# EAGLE design project github (EAGLE 9.6.1)
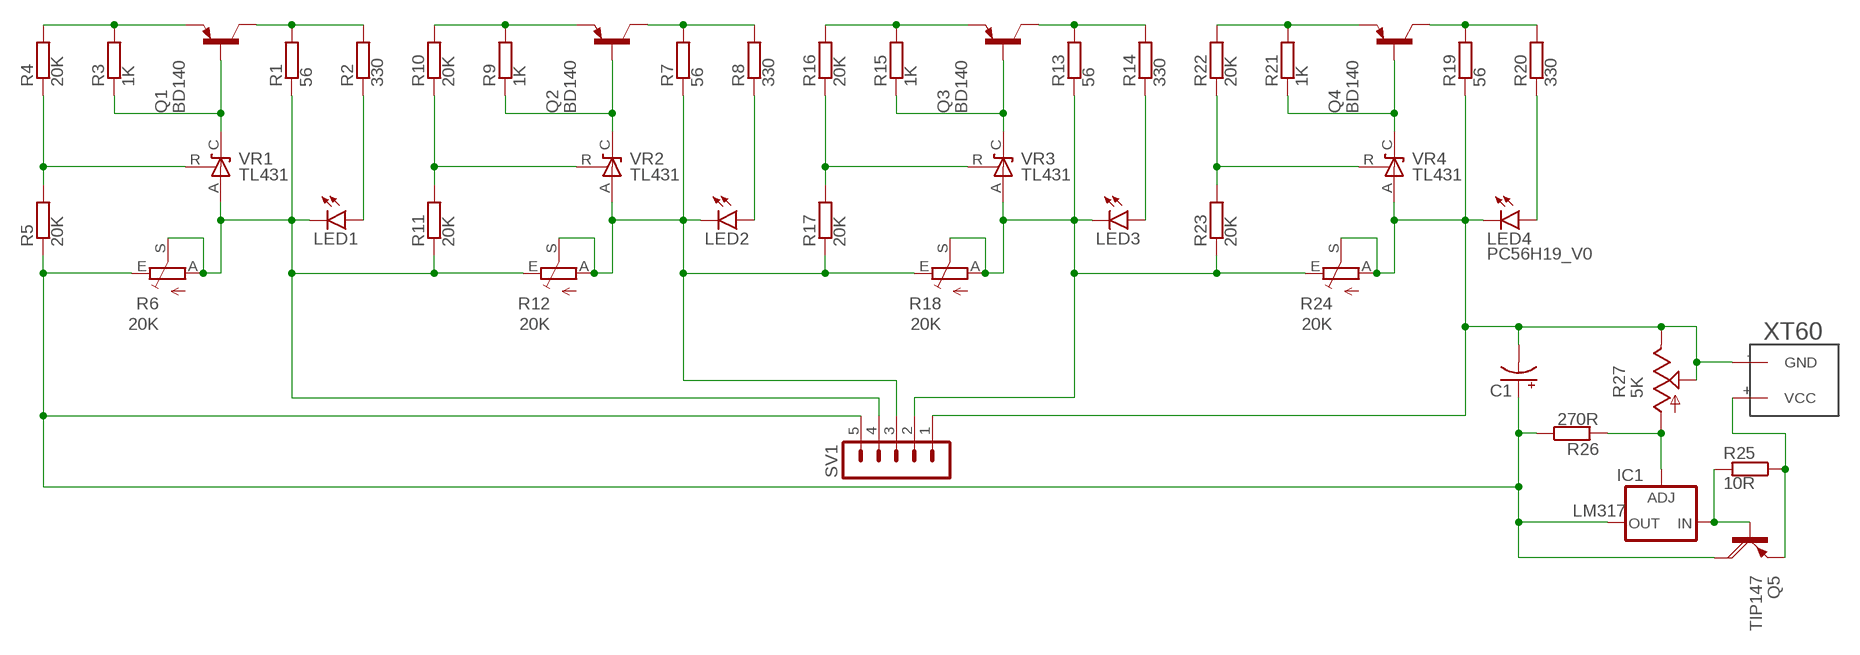
[diagram p0: schematic, sheet 1]

## Parts
C1  CPOL-US153CLV-0810  [153CLV-0810]
IC1  LM317  LM317MABDT  [DPACK]
LED1  PC56H19_V0  [PC56H19_V0]
LED2  PC56H19_V0  [PC56H19_V0]
LED3  PC56H19_V0  [PC56H19_V0]
LED4  PC56H19_V0  [PC56H19_V0]
Q1  BD140  [TO126]
Q2  BD140  [TO126]
Q3  BD140  [TO126]
Q4  BD140  [TO126]
Q5  TIP147  [SOT93]
R1  56  SMK  [SMK]
R2  330  SMK  [SMK]
R3  1K  SMK  [SMK]
R4  20K  SMK  [SMK]
R5  20K  SMK  [SMK]
R6  20K  TRIM_EU-RJ9W  [RJ9W]
R7  56  SMK  [SMK]
R8  330  SMK  [SMK]
R9  1K  SMK  [SMK]
R10  20K  SMK  [SMK]
R11  20K  SMK  [SMK]
R12  20K  TRIM_EU-RJ9W  [RJ9W]
R13  56  SMK  [SMK]
R14  330  SMK  [SMK]
R15  1K  SMK  [SMK]
R16  20K  SMK  [SMK]
R17  20K  SMK  [SMK]
R18  20K  TRIM_EU-RJ9W  [RJ9W]
R19  56  SMK  [SMK]
R20  330  SMK  [SMK]
R21  1K  SMK  [SMK]
R22  20K  SMK  [SMK]
R23  20K  SMK  [SMK]
R24  20K  TRIM_EU-RJ9W  [RJ9W]
R25  10R  SMK  [SMK]
R26  270R  SMK  [SMK]
R27  5K  TRIM_US-RJ9W  [RJ9W]
SV1  MA05-1  [MA05-1]
U$1  XT60  [XT60]
VR1  TL431  [TO-92_RAC]
VR2  TL431  [TO-92_RAC]
VR3  TL431  [TO-92_RAC]
VR4  TL431  [TO-92_RAC]

## Nets
N$1: Q1.1(E) R3.1 R4.1
N$2: R4.2 R5.1 VR1.R
N$3: Q1.3(B) R3.2 VR1.C
N$4: Q1.2(C) R1.1 R2.1
N$5: LED1.1(C) LED1.3(C) R1.2 R6.A R6.S R11.2 R12.E SV1.4 VR1.A
N$6: R10.2 R11.1 VR2.R
N$7: C1.+ IC1.4(OUT) Q5.C R5.2 R6.E R26.1 SV1.5
N$8: C1.- LED4.1(C) LED4.3(C) R19.2 R24.A R24.S R27.E R27.S SV1.1 U$1.-(GND) VR4.A
N$9: Q2.3(B) R9.2 VR2.C
N$10: Q2.1(E) R9.1 R10.1
N$11: Q2.2(C) R7.1 R8.1
N$12: LED2.1(C) LED2.3(C) R7.2 R12.A R12.S R17.2 R18.E SV1.3 VR2.A
N$13: IC1.1(ADJ) R26.2 R27.A
N$15: R16.2 R17.1 VR3.R
N$16: Q3.3(B) R15.2 VR3.C
N$17: Q3.1(E) R15.1 R16.1
N$18: Q3.2(C) R13.1 R14.1
N$19: LED3.1(C) LED3.3(C) R13.2 R18.A R18.S R23.2 R24.E SV1.2 VR3.A
N$20: IC1.3(IN) Q5.B R25.2
N$21: LED3.2(A) LED3.4(A) R14.2
N$22: R22.2 R23.1 VR4.R
N$23: Q4.3(B) R21.2 VR4.C
N$24: Q4.1(E) R21.1 R22.1
N$25: Q4.2(C) R19.1 R20.1
N$27: Q5.E R25.1 U$1.+(VCC)
N$28: LED4.2(A) LED4.4(A) R20.2
N$29: LED1.2(A) LED1.4(A) R2.2
N$30: LED2.2(A) LED2.4(A) R8.2

## Library data of the parts
C1 = rcl:CPOL-US: POLARIZED CAPACITOR, American symbol; SPICEPREFIX: C
IC1 = v-reg:LM317?*: 500 mA Adjustable Output Positive Voltage Regulator Source: http://www.onsemi.co.jp .. LM317M-D.PDF
LED1-LED4 = led:PC56H19_V0: Lextar white SMD LED Source: PC56H19_20150317.pdf www.lextar.com
Q1-Q4 = transistor-pnp:BD140: PNP Transistor
Q5 = transistor-power:TIP147: PNP DARLINGTON TRANSISTOR
R1-R5 R7-R11 R13-R17 R19-R23 R25 R26 = resistor-shunt:SMK: SMD SHUNT RESISTOR; OC_FARNELL: unknown; OC_NEWARK: unknown
R6 R12 R18 R24 = pot:TRIM_EU-: POTENTIOMETER
R27 = pot:TRIM_US-: POTENTIOMETER
SV1 = con-lstb:MA05-1: PIN HEADER; OC_FARNELL: unknown; OC_NEWARK: unknown
U$1 = XT60:XT60: XT60
VR1-VR4 = voltage regulators:TL431: Voltage regulator

## Board
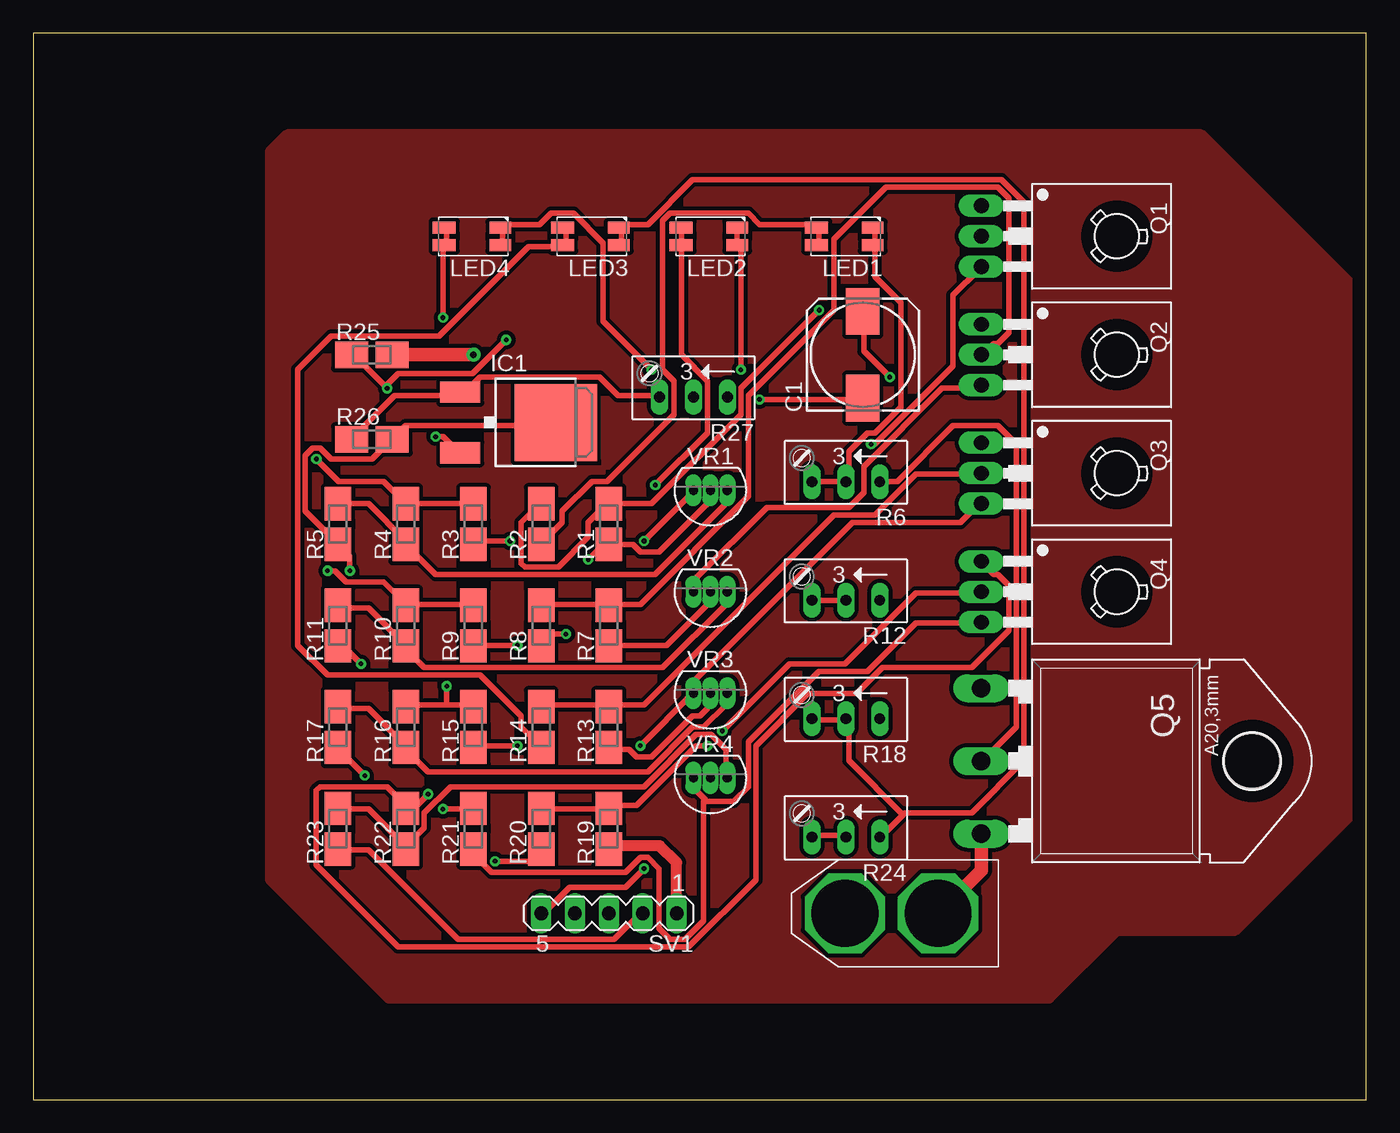
[diagram p1: board, top side]
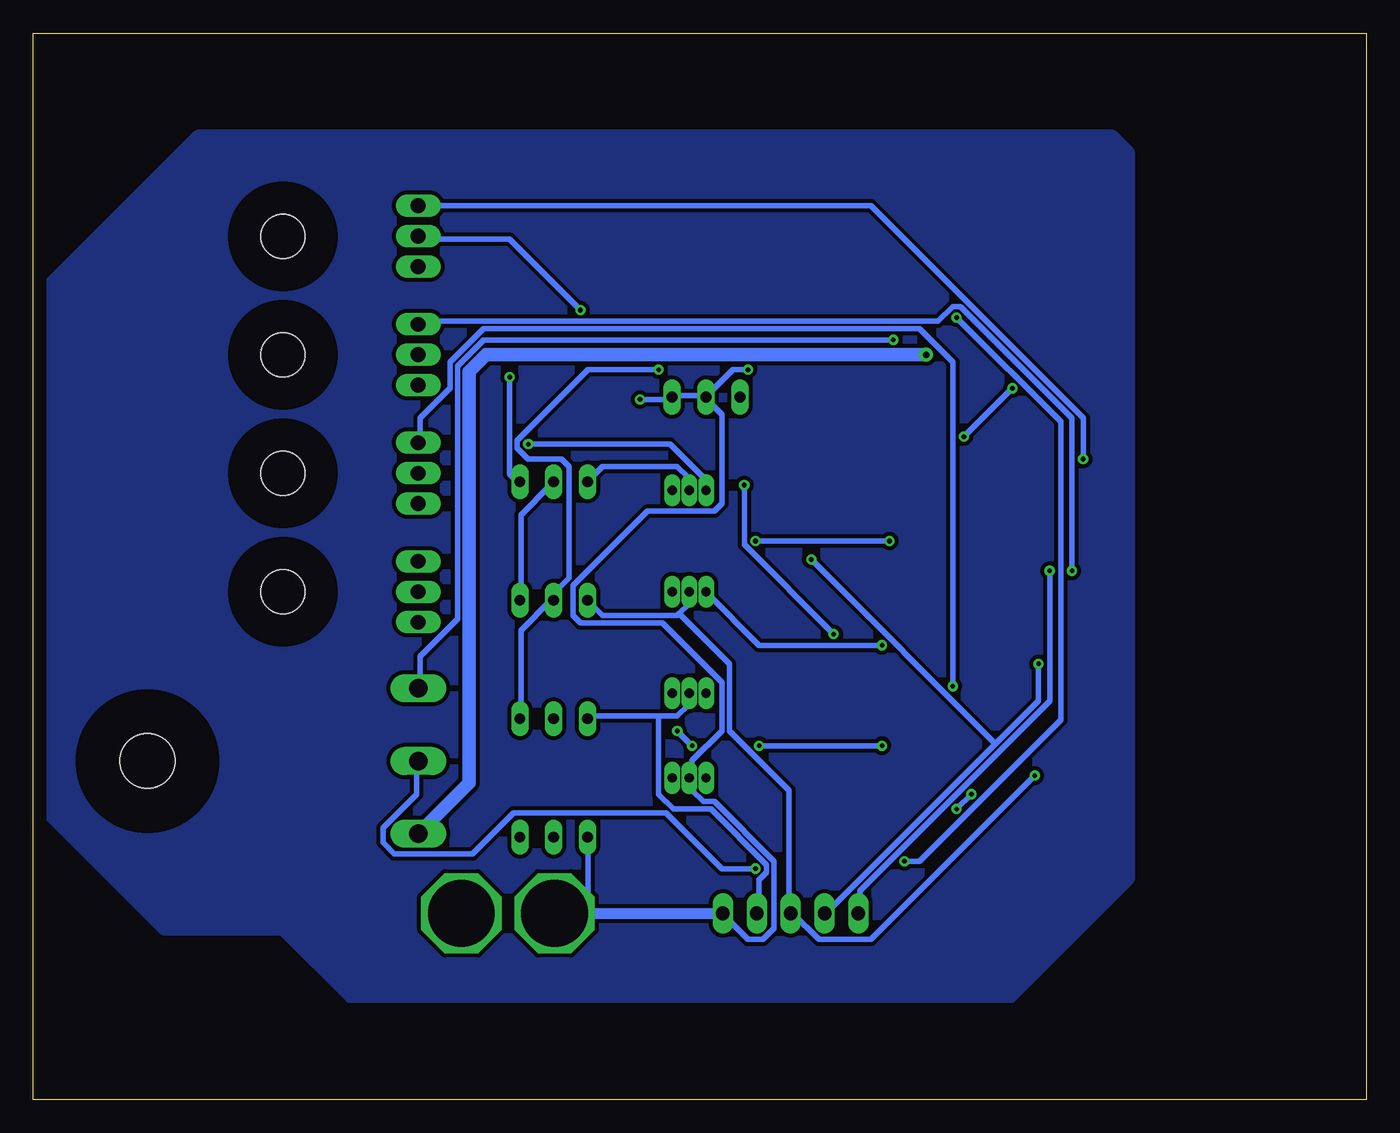
[diagram p2: board, bottom side, seen from below]

Size 100 x 80 mm. Coordinates in mm from the lower left corner, seen from the top.
Outline: 0,0 100,0 100,80 0,80 0,0
Copper layers (1*16): Top 0.035mm / dielectric 1.5mm / Bottom 0.035mm
Design rules "default *": minimum track width 16mil, minimum drill 0.35mm, track to track 6mil, track to pad 6mil, pad to pad 6mil, via to via 6mil, smd to smd 6mil, copper to edge 40mil, drill to drill 6mil, minimum pad ring 10mil, minimum via ring 8mil, stop-mask expansion 4mil, vias tented up to drill 0mil, thermal gap 10mil

### Footprints (pad centres in the part's own frame; a part is rotated, then mirrored left to right if it is on the bottom)
153CLV-0810 = smd 3.5 x 2.5: + 3.25,0; - -3.25,0
DPACK = smd 1.6 x 3: 1 -2.28,-4.8; 3 2.28,-4.8 | smd 5.8 x 6.2: 4 0,2.38
PC56H19_V0 = smd 1.63 x 0.9: 1 -2.01,0.65; 3 -2.01,-0.645 | smd 1.73 x 0.9: 2 2.195,0.65; 4 2.195,-0.65
TO126 = drill 1.118 long: 1 -2.286,-5.08; 2 0,-5.08; 3 2.286,-5.08 | hole 3.302: 0,5.08
SOT93 = drill 1.397 long: B -5.461,-10.16; C 0,-10.16; E 5.461,-10.16 | hole 4.115: 0,10.16
SMK = smd 2.5 x 2: 1 1.524,0; 2 -1.524,0
RJ9W = drill 0.813 long: A 2.54,0.635; E -2.54,0.635; S 0,0.635
MA05-1 = drill 1.016 long: 1 -5.08,0; 2 -2.54,0; 3 0,0; 4 2.54,0; 5 5.08,0
XT60 = drill 5 octagon: + 4.5,0; - 11.5,0
TO-92_RAC = drill 0.7 pad 1 long: A 0,0; C 1.27,0; R -1.27,0

### Placement (x,y rotation side)
C1  62.23,55.88 90 top
IC1  36.83,50.8 270 top
LED1  60.96,64.77 180 top
LED2  50.8,64.77 180 top
LED3  41.91,64.77 180 top
LED4  33.02,64.77 180 top
Q1  76.2,64.77 270 top
Q2  76.2,55.88 270 top
Q3  76.2,46.99 270 top
Q4  76.2,38.1 270 top
Q5  81.28,25.4 270 top
R1  43.18,43.18 90 top
R2  38.1,43.18 90 top
R3  33.02,43.18 90 top
R4  27.94,43.18 90 top
R5  22.86,43.18 90 top
R6  60.96,46.99 180 top
R7  43.18,35.56 90 top
R8  38.1,35.56 90 top
R9  33.02,35.56 90 top
R10  27.94,35.56 90 top
R11  22.86,35.56 90 top
R12  60.96,38.1 180 top
R13  43.18,27.94 90 top
R14  38.1,27.94 90 top
R15  33.02,27.94 90 top
R16  27.94,27.94 90 top
R17  22.86,27.94 90 top
R18  60.96,29.21 180 top
R19  43.18,20.32 90 top
R20  38.1,20.32 90 top
R21  33.02,20.32 90 top
R22  27.94,20.32 90 top
R23  22.86,20.32 90 top
R24  60.96,20.32 180 top
R25  25.4,55.88 0 top
R26  25.4,49.53 0 top
R27  49.53,53.34 180 top
SV1  43.18,13.97 180 top
U$1  72.39,13.97 180 top
VR1  50.8,45.72 180 top
VR2  50.8,38.1 180 top
VR3  50.8,30.48 180 top
VR4  50.8,24.13 180 top

### Tracks (layer width: path | path; a pad name or v marks a point on that pad's centre or on a via)
COPPER
  pour Top (isolate 0.305, no thermals): 17.78,71.12 17.78,16.51 26.67,7.62 76.2,7.62 81.28,12.7 90.17,12.7 99.06,21.59 99.06,60.96 87.63,72.39 19.05,72.39
GND
  pour Bottom (isolate 0.305, no thermals): 17.78,71.12 17.78,16.51 26.67,7.62 76.2,7.62 81.28,12.7 90.17,12.7 99.06,21.59 99.06,60.96 87.63,72.39 19.05,72.39
N$1  (via drill 0.35)
  Top 0.406: R3.1 R4.1 26.26,46.38 22.91,46.38 v21.23,48.06
  Bottom 0.406: Q1.1 37.16,67.06 21.23,51.13 v21.23,48.06
N$2
  Top 0.406: VR1.R 51.97,45.54 51.97,44.7 46.66,39.4 30.18,39.4 27.94,41.63 R4.2 27.94,41.91 25.15,44.7 R5.1
N$3  (via drill 0.35)
  Top 0.406: v62.87,49.17 63.14,49.17 69.01,55.04 69.01,60.35 70.97,62.31 Q1.3 | v35.76,41.91 33.25,41.91 R3.2 | v45.82,41.91 49.45,45.54 VR1.C
  Bottom 0.406: v62.87,49.17 52.25,49.17 49.73,46.66 49.73,45.82 VR1.C | v45.82,41.91 v35.76,41.91
N$4  (via drill 0.35)
  Top 0.406: R2.1 38,44.7 36.6,43.31 36.6,40.23 36.88,39.95 39.4,39.95 41.63,42.19 41.63,43.31 43.03,44.7 R1.1 46.38,44.7 53.09,51.41 53.09,53.37 v58.95,59.23
  Bottom 0.406: v58.95,59.23 64.26,64.54 70.97,64.54 Q1.2
N$5  (via drill 0.35)
  Top 0.406: v24.59,32.69 23.47,33.81 22.91,33.81 R11.2 | VR1.A 50.57,45.54 50.57,44.7 46.94,41.07 45.54,41.07 44.98,41.63 43.31,41.63 R1.2 43.03,41.91 v41.63,40.51 | LED1.3 63.14,65.38 63.14,64.26 LED1.1 63.14,63.98 63.14,61.75 65.1,59.79 65.1,51.97 63.14,50.01 62.59,50.01 61.19,48.62 61.19,46.38 R6.S 60.91,46.38 58.67,46.38 R6.A
  Bottom 0.406: v24.59,32.69 24.59,29.9 27.8,26.68 | 27.8,26.68 40.51,13.97 SV1.4 | R6.A 57.28,47.5 51.69,47.5 50.85,46.66 50.85,45.82 VR1.A | R12.E 63.42,37.72 63.42,43.87 61.19,46.1 R6.S | v41.63,40.51 27.8,26.68
N$6
  Top 0.406: VR2.R 51.97,38 51.97,37.16 47.22,32.41 29.34,32.41 27.94,33.81 R10.2 27.94,34.09 25.15,36.88 22.91,36.88 R11.1
N$7  (via drill 0.35)
  Top 0.406: R6.E 63.7,46.38 64.82,46.38 69.01,50.57 72.36,50.57 73.76,49.17 73.76,27.94 71.25,25.43 Q5.C | v64.26,54.2 62.31,56.16 62.31,58.95 C1.+ | v23.75,39.67 23.75,40.79 22.91,41.63 R5.2 22.63,41.91 20.4,44.15 20.4,48.34 20.95,48.9 21.51,48.9 22.35,48.06 25.43,48.06 26.82,49.45 R26.1 27.1,49.73 27.94,50.57 39.12,50.57 IC1.4 | v45.82,17.32 44.42,15.93 40.23,15.93 38.28,13.97 SV1.5
  Bottom 0.406: v64.26,54.2 64.26,46.94 63.7,46.38 R6.E | v23.75,39.67 23.75,29.9 38,15.65 38,13.97 SV1.5 | v45.82,17.32 48.34,17.32 52.53,21.51 63.98,21.51 67.06,18.44 72.92,18.44 73.76,19.28 73.76,20.4 71.25,22.91 71.25,25.15 Q5.C
N$8  (via drill 0.35)
  Top 0.406: R24.A 58.67,19.84 60.91,19.84 R24.S | LED4.1 35.2,64.26 35.2,65.38 LED4.3 35.2,65.66 38,65.66 38.84,66.5 40.51,66.5 42.75,64.26 42.75,58.4 v46.38,54.76 | v54.48,52.53 62.03,52.53 C1.-
  Top 0.813: SV1.1 48.26,17.78 46.99,19.05 43.43,19.05 R19.2
  Bottom 0.406: SV1.1 48.06,13.69 46.38,12.01 45.26,12.01 44.42,12.85 44.42,17.88 48.9,22.35 49.73,22.35 50.57,23.19 50.57,24.03 VR4.A 50.57,24.31 50.57,25.43 48.34,27.66 48.34,31.29 52.81,35.76 58.95,35.76 59.51,36.32 59.51,38.56 53.92,44.15 48.9,44.15 48.34,44.7 48.34,51.41 49.45,52.53 R27.S | R24.A 58.4,19.56 58.4,14.25 U$1.- | v46.38,54.76 47.5,54.76 49.45,52.81 R27.S | R27.S 49.73,52.81 51.97,52.81 R27.E 52.25,52.53 v54.48,52.53
  Bottom 0.813: U$1.- SV1.1
N$9  (via drill 0.35)
  Top 0.406: VR2.C 49.73,38.28 49.73,39.12 55.04,44.42 61.19,44.42 62.31,45.54 62.31,47.5 68.17,53.37 70.97,53.37 Q2.3 | v36.32,34.09 33.25,34.09 R9.2
  Bottom 0.406: v36.32,34.09 45.54,34.09 49.45,38 VR2.C
N$10  (via drill 0.35)
  Top 0.406: 27.94,37.16 32.97,37.16 R9.1 | v22.07,39.67 22.63,39.67 23.47,38.84 26.26,38.84 27.94,37.16 | 27.94,37.16 R10.1
  Bottom 0.406: v22.07,39.67 22.07,51.13 30.45,59.51 31.01,59.51 32.13,58.4 70.97,58.4 Q2.1
N$11
  Top 0.406: R8.1 38.28,37.16 43.03,37.16 R7.1 43.31,37.16 45.54,37.16 53.65,45.26 53.65,52.81 60.07,59.23 60.07,64.54 63.98,68.45 72.36,68.45 73.2,67.61 73.2,57.56 72.36,56.72 72.08,56.72 71.25,55.88 Q2.2
N$12  (via drill 0.35)
  Top 0.406: v24.87,24.31 22.91,26.26 R17.2 | R7.2 43.31,34.09 47.5,34.09 50.57,37.16 50.57,38 VR2.A | LED2.3 52.81,65.38 52.81,64.26 LED2.1 53.09,63.98 v53.09,54.76 | R12.A 58.67,37.44 60.91,37.44 R12.S
  Bottom 0.406: v24.87,24.31 37.16,12.01 41.07,12.01 43.03,13.97 SV1.3 43.31,13.97 43.31,23.19 47.78,27.66 47.78,32.69 51.55,36.46 | 51.55,36.46 51.69,36.32 57.28,36.32 R12.A | 51.55,36.46 50.85,37.16 50.85,38 VR2.A | v53.09,54.76 58.4,54.76 63.7,49.45 63.7,48.9 62.87,48.06 60.35,48.06 59.79,47.5 59.79,39.12 61.19,37.72 R12.S 61.19,37.44 63.42,35.2 63.42,28.78 R18.E
N$13
  Top 0.406: R26.2 24.03,49.73 27.1,52.81 31.85,52.81 IC1.1 32.13,52.81 33.53,54.2 42.47,54.2 43.87,52.81 46.94,52.81 R27.A
N$15
  Top 0.406: VR3.R 51.97,30.45 51.97,29.62 50.29,27.94 49.45,27.94 46.1,24.59 29.62,24.59 27.94,26.26 R16.2 27.94,26.54 25.15,29.34 22.91,29.34 R17.1
N$16  (via drill 0.35)
  Top 0.406: Q3.3 70.97,44.7 69.57,43.31 61.47,43.31 49.73,31.57 49.73,30.73 VR3.C 49.45,30.45 v45.54,26.54 | v36.32,26.54 33.25,26.54 R15.2
  Bottom 0.406: v45.54,26.54 v36.32,26.54
N$17  (via drill 0.35)
  Top 0.406: 31.01,29.62 32.97,29.62 R15.1 | 31.01,29.62 27.94,29.62 R16.1 | 31.01,29.62 v31.01,31.01
  Bottom 0.406: v31.01,31.01 31.01,55.32 33.53,57.84 66.22,57.84 68.73,55.32 68.73,53.37 70.97,51.13 70.97,49.45 Q3.1
N$18
  Top 0.406: R14.1 38.28,29.62 43.03,29.62 R13.1 43.31,29.62 45.82,29.62 60.07,43.87 63.14,43.87 66.22,46.94 70.97,46.94 Q3.2
N$19
  Top 0.406: R23.2 22.91,18.72 25.15,18.72 31.85,12.01 43.59,12.01 45.54,13.97 SV1.2 | R13.2 43.31,26.26 44.7,26.26 45.26,25.7 46.38,25.7 49.45,28.78 50.01,28.78 50.57,29.34 50.57,30.45 VR3.A | R18.A 58.67,28.5 60.91,28.5 R18.S 61.19,28.5 61.19,25.43 65.24,21.37 | LED3.1 44.15,64.26 44.15,65.38 LED3.3 44.15,65.66 46.1,65.66 49.45,69.01 72.64,69.01 74.32,67.33 74.32,25.43 70.41,21.51 65.38,21.51 65.24,21.37 | 65.24,21.37 63.7,19.84 R24.E
  Bottom 0.406: 53.09,28.78 58.4,28.78 R18.A | 53.09,28.78 51.69,28.78 50.85,29.62 50.85,30.45 VR3.A | 53.09,28.78 53.09,22.91 51.97,21.79 49.17,21.79 44.98,17.6 44.98,17.04 45.54,16.48 45.54,13.97 SV1.2
N$20  (via drill 0.35)
  Top 0.406: v30.18,49.73 30.73,49.73 31.85,48.62 IC1.3 | R25.2 24.03,55.88 v26.54,53.37 26.54,53.65 27.38,54.48 32.97,54.48 v35.48,57
  Bottom 0.406: v30.18,49.73 v26.54,53.37 | v35.48,57 66.22,57 68.17,55.04 68.17,36.04 70.97,33.25 70.97,31.01 Q5.B
N$21
  Top 0.406: LED3.4 39.95,65.38 39.95,64.26 LED3.2 39.67,63.98 37.16,63.98 30.45,57.28 22.35,57.28 19.84,54.76 19.84,34.09 22.07,31.85 33.53,31.85 36.6,28.78 36.6,27.94 38,26.54 R14.2
N$22
  Top 0.406: 27.94,19 29.34,20.4 29.34,21.51 31.29,23.47 45.82,23.47 49.73,27.38 50.85,27.38 51.97,26.26 51.97,24.31 VR4.R | 27.94,19 25.15,21.79 22.91,21.79 R23.1 | 27.94,19 R22.2
N$23
  Top 0.406: 50.43,22.49 50.57,22.35 52.53,22.35 53.65,23.47 53.65,26.82 58.95,32.13 62.59,32.13 66.22,35.76 70.97,35.76 Q4.3 | 50.43,22.49 49.73,23.19 49.73,24.03 VR4.C | R21.2 33.25,18.72 33.25,18.16 34.37,17.04 44.42,17.04 45.54,18.16 46.1,18.16 46.94,17.32 46.94,12.85 47.78,12.01 48.9,12.01 50.29,13.41 50.29,22.35 50.43,22.49
N$24  (via drill 0.35)
  Top 0.406: 27.94,22.07 28.78,22.07 v29.62,22.91 | v30.73,21.79 32.97,21.79 R21.1 | 27.94,22.07 26.54,23.47 21.51,23.47 21.23,23.19 21.23,17.6 27.38,11.46 49.17,11.46 54.2,16.48 54.2,26.54 58.12,30.45 61.75,30.45 63.7,32.41 70.41,32.41 73.2,35.2 73.2,38.56 72.36,39.4 72.08,39.4 71.25,40.23 Q4.1 | 27.94,22.07 R22.1
  Bottom 0.406: v30.73,21.79 v29.62,22.91
N$25  (via drill 0.35)
  Top 0.406: R20.1 38.28,21.79 43.03,21.79 R19.1 43.31,22.07 45.26,22.07 49.73,26.54 v50.57,26.54 | v51.69,27.66 56.72,32.69 60.91,32.69 66.22,38 70.97,38 Q4.2
  Bottom 0.406: v50.57,26.54 v51.69,27.66
N$27  (via drill 0.5 pad 1.05)
  Top 1.016: U$1.+ 71.12,17.2 Q5.E | R25.1 v33.02,55.88
  Bottom 1.016: Q5.E 67.31,23.75 67.31,54.61 66.04,55.88 v33.02,55.88
N$28  (via drill 0.35)
  Top 0.406: LED4.4 31.01,65.38 31.01,64.26 LED4.2 30.73,63.98 v30.73,58.67 | v34.65,17.88 37.16,17.88 38,18.72 R20.2
  Bottom 0.406: v30.73,58.67 22.91,50.85 22.91,28.5 33.53,17.88 v34.65,17.88
N$29
  Top 0.406: LED1.2 58.95,64.26 58.95,65.38 LED1.4 58.67,65.66 54.48,65.66 53.65,66.5 47.78,66.5 47.22,65.94 47.22,54.76 48.06,53.92 48.06,51.41 43.03,46.38 41.91,46.38 39.67,44.15 39.67,43.31 38.28,41.91 R2.2
N$30  (via drill 0.35)
  Top 0.406: LED2.4 48.62,65.38 48.62,64.26 LED2.2 48.62,63.98 48.62,55.88 50.57,53.92 50.57,50.01 v46.66,46.1 | v39.95,34.92 39.12,34.92 38.28,34.09 R8.2
  Bottom 0.406: v46.66,46.1 46.66,41.63 v39.95,34.92